# Altium schematic sheet Main.SchDoc
size A; SheetNumber: 1; SheetTotal: 1
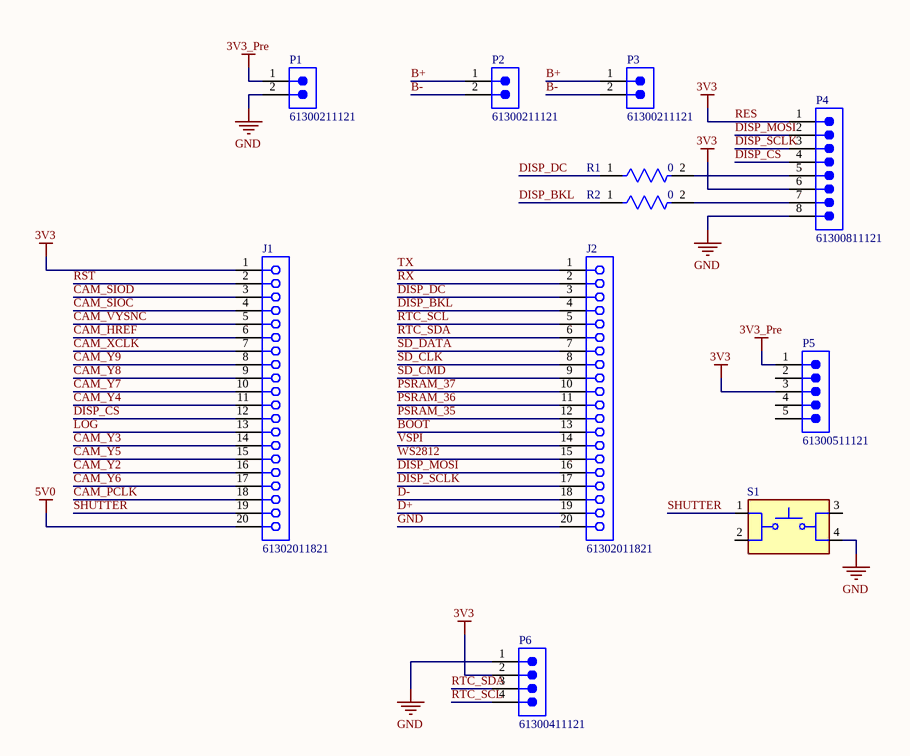
[diagram p0: Main.SchDoc]

## Parts
J1  61302011821  [61302011821]
J2  61302011821  [61302011821]
P1  61300211121  [61300211121]
P2  61300211121  [61300211121]
P3  61300211121  [61300211121]
P4  61300811121  [61300811121]
P5  61300511121  [61300511121]
P6  61300411121  [61300411121]
R1  0  [FP-RMCF1206-IPC_C]
R2  0  [FP-RMCF1206-IPC_C]
S1  SWT0325-073016TSK_REVA  [SW_SWT0325-073016TSK_REVA]  (value not drawn)

## Nets
3V3_Pre: P1.1 P5.1
5V0: J1.20
GND: J2.20 P1.2 P4.8 P6.1 S1.4
RES: J1.1 P4.1 P4.6 P5.3 P6.2  [also labelled 3V3]
B+: P2.1 P3.1
B-: P2.2 P3.2
BOOT: J2.13
CAM_HREF: J1.6
CAM_PCLK: J1.18
CAM_SIOC: J1.4
CAM_SIOD: J1.3
CAM_VYSNC: J1.5
CAM_XCLK: J1.7
CAM_Y2: J1.16
CAM_Y3: J1.14
CAM_Y4: J1.11
CAM_Y5: J1.15
CAM_Y6: J1.17
CAM_Y7: J1.10
CAM_Y8: J1.9
CAM_Y9: J1.8
D+: J2.19
D-: J2.18
DISP_BKL: J2.4 R2.1
DISP_CS: J1.12 P4.4
DISP_DC: J2.3 R1.1
DISP_MOSI: J2.16 P4.2
DISP_SCLK: J2.17 P4.3
LOG: J1.13
PSRAM_35: J2.12
PSRAM_36: J2.11
PSRAM_37: J2.10
RST: J1.2
RTC_SCL: J2.5 P6.4
RTC_SDA: J2.6 P6.3
RX: J2.2
SD_CLK: J2.8
SD_CMD: J2.9
SD_DATA: J2.7
SHUTTER: J1.19 S1.1
TX: J2.1
VSPI: J2.14
WS2812: J2.15
NetP4_5: P4.5 R1.2
NetP4_7: P4.7 R2.2

Not connected (* = marked no-connect by the designer): P5 2 4 5; S1 2 3

## Library data of the parts
J1 J2 = CMP-1502-01348-4: THT Vertical Socket Header WR-PHD, Pitch 2.54 mm, Single Row, 20 pins; Contact Resistance: 20mΩ; Gender: Female; Current Rating: 3A; Operating Supply Voltage: 250V; Lead Pitch: 2.54mm; Number of Pins: 20; Orientation: Vertical
P1-P3 = CMP-1712-00002-7: THT Vertical Pin Header WR-PHD, Pitch 2.54 mm, Single Row, 2 pins; Pitch: 2.54mm; Number of Contacts: 2; Connector Type: Male Pin; Gender: Male; Contact Resistance: 20mΩ; Operating Supply Voltage: 250V; Current Rating: 3A; Housing Material: PBT; RoHS: Compliant; Lead Free: Lead Free; Contact Material: Gold; REACH SVHC: No; Min Operating Temperature: -40°C; Termination: Through Hole; Number of Pins: 2; Contact Gender: Male; Packaging: Bulk; Lead Pitch: 2.54mm; Contact Plating: Gold; Orientation: Vertical; Mount: Through Hole; Height: 8.94mm; Color: Black; Number of Positions: 2; Contact Mating Length: 5.9944mm; Max Operating Temperature: 105°C; Voltage Rating: 250V; Number of Rows: 1
P4 = CMP-1502-01076-4: THT Vertical Pin Header WR-PHD, Pitch 2.54 mm, Single Row, 8 pins; Pitch: 2.54mm; Voltage Rating: 250V; Connector Type: Male Pin; Current Rating: 3A; Contact Resistance: 20mΩ; Number of Positions: 8; Gender: Male; Contact Mating Length: 5.9944mm; Orientation: Vertical; Contact Plating: Gold; Mount: Through Hole; Min Operating Temperature: -40°C; Packaging: Bulk; Height: 8.54mm; Number of Pins: 8; Contact Material: Gold; Operating Supply Voltage: 250V; Termination: Solder; RoHS: Compliant; Color: Black; Number of Contacts: 8; Lead Pitch: 2.54mm; Number of Rows: 1; Max Operating Temperature: 105°C
P5 = CMP-1502-01068-4: THT Vertical Pin Header WR-PHD, Pitch 2.54 mm, Single Row, 5 pins; Number of Contacts: 5; Connector Type: Male Pin; Operating Supply Voltage: 250V; Contact Resistance: 20mΩ; Gender: Male; Pitch: 2.54mm; Current Rating: 3A; Min Operating Temperature: -40°C; Contact Material: Gold; Color: Black; RoHS: Compliant; Number of Rows: 1; Lead Free: Lead Free; Height: 8.89mm; Contact Plating: Gold; Number of Pins: 5; Orientation: Vertical; Voltage Rating: 250V; Packaging: Bulk; Number of Positions: 5; Max Operating Temperature: 105°C; Termination: Solder; Lead Pitch: 2.54mm; Contact Mating Length: 5.9944mm; Mount: Through Hole
P6 = CMP-1502-01064-4: THT Vertical Pin Header WR-PHD, Pitch 2.54 mm, Single Row, 4 pins; Connector Type: Male Pin; Gender: Male; Current Rating: 3A; Number of Positions: 4; Operating Supply Voltage: 250V; Contact Resistance: 20mΩ; Pitch: 2.54mm; Max Operating Temperature: 105°C; Mount: Through Hole; Contact Material: Gold; Contact Plating: Gold; Number of Contacts: 4; Orientation: Vertical; Packaging: Bulk; Contact Mating Length: 5.9944mm; Voltage Rating: 250V; Number of Rows: 1; Height: 8.89mm; Lead Free: Lead Free; Lead Pitch: 2.54mm; Number of Pins: 4; Color: Black; Min Operating Temperature: -40°C; RoHS: Compliant; Termination: Solder
R1 R2 = CMP-26527-003312-1: 2.21kΩ ±1% 0.25W 1206 Thick Film Chip Resistor AEC-Q200 compliant; Temperature Coefficient: 100ppm/°C; Resistance: 2.21kR; Max Power Dissipation: 250mW; Packaging: Tape and Reel; Resistor Type: Thick Film; Max Operating Temperature: 155°C; Features: Automotive AEC-Q200; Height: 0.028inch; Package Quantity: 10000; Width: 0.063inch; Tolerance: 1%; Mount: Surface Mount; Number of Terminations: 2; Min Operating Temperature: -55°C; Series: RMCF; RoHS Compliant: Yes; Length: 0.126inch; Case/Package: 1206
S1 = SWT0325-073016TSK_REVA: 6mm x 6mm Through Hole Tactile Switch; MF: Global Connector Technology; SnapEDA_Link: https://www.snapeda.com/parts/SWT0325-073016TSK/Global+Connector+Technology/view-part/?ref=snap; Package: None; Value: *; MP: SWT0325-073016TSK; Check_prices: https://www.snapeda.com/parts/SWT0325-073016TSK/Global+Connector+Technology/view-part/?ref=eda